# Altium schematic sheet FPGA Board Top.SchDoc
size C; SheetNumber: 1; SheetTotal: 4
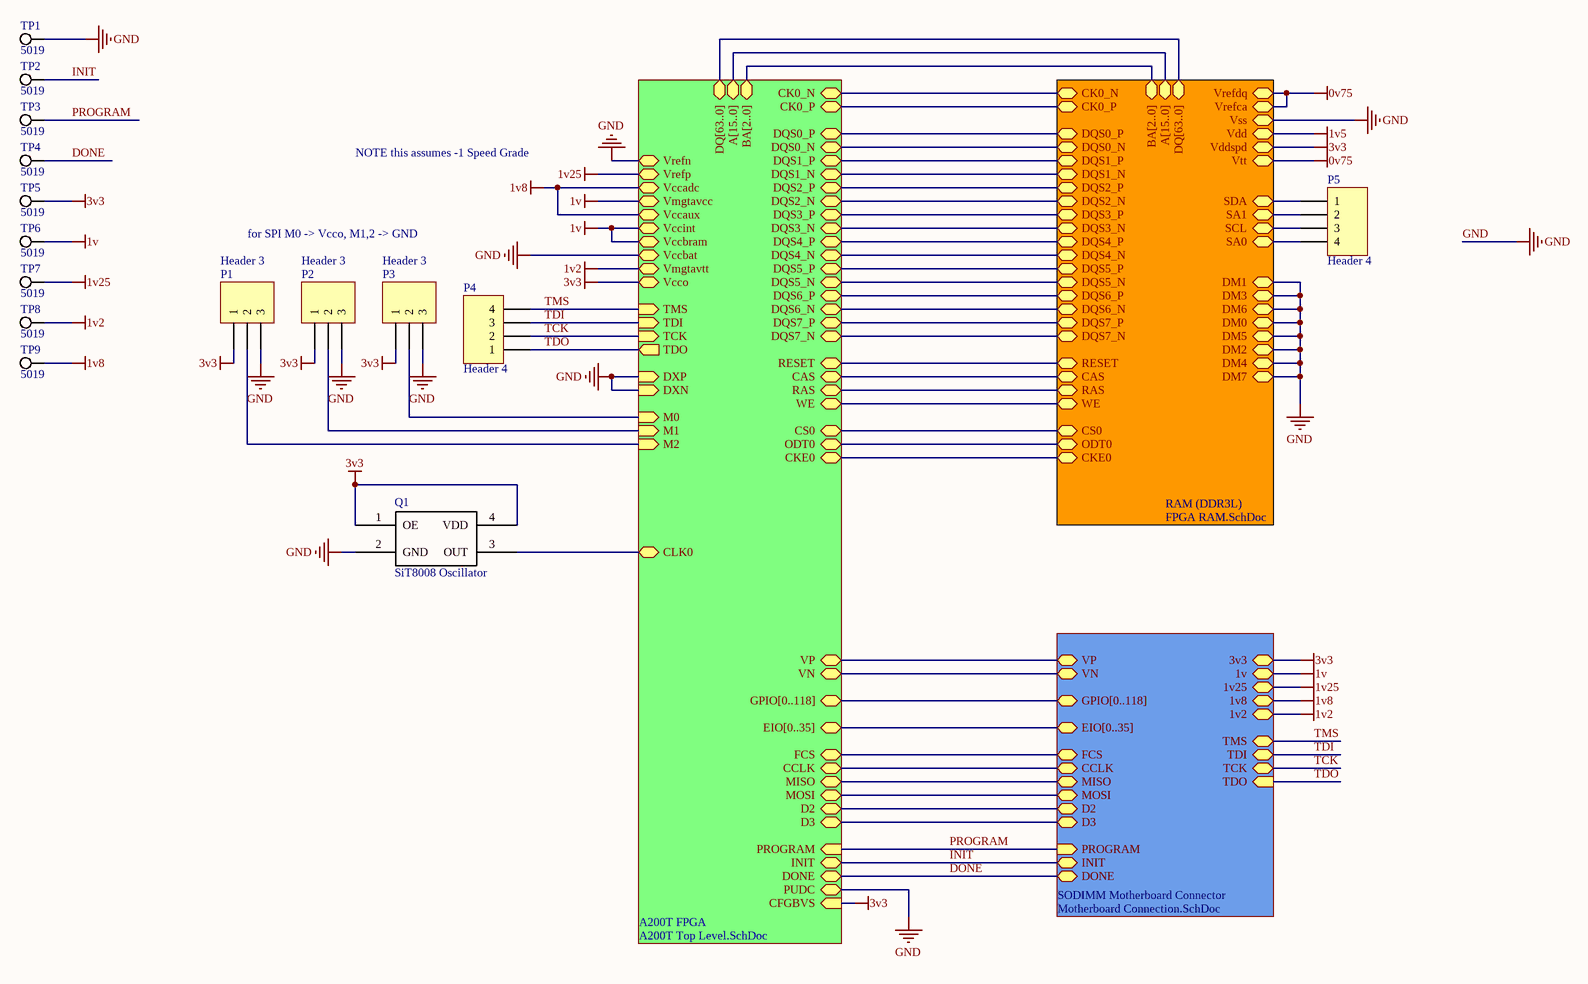
[diagram p0: FPGA Board Top.SchDoc]

## Parts
P1  Header 3  [HDR1X3]
P2  Header 3  [HDR1X3]
P3  Header 3  [HDR1X3]
P4  Header 4  [HDR1X4]
P5  Header 4  [HDR1X4]
Q1  SiT8008 Oscillator  [SiT8008 2.5x2]
TP1  5019  [KSTN-5019_V]
TP2  5019  [KSTN-5019_V]
TP3  5019  [KSTN-5019_V]
TP4  5019  [KSTN-5019_V]
TP5  5019  [KSTN-5019_V]
TP6  5019  [KSTN-5019_V]
TP7  5019  [KSTN-5019_V]
TP8  5019  [KSTN-5019_V]
TP9  5019  [KSTN-5019_V]

## Sub-sheets
A200T FPGA = A200T Top Level.SchDoc: BA[2..0] (bidir), A[15..0] (bidir), DQS1_P (bidir), DQS2_N (bidir), DQS7_N (bidir), DQS0_P (bidir), DQS6_N (bidir), DQS6_P (bidir), DQS1_N (bidir), DQS7_P (bidir), DQS4_P (bidir), DQS5_N (bidir), DQS3_P (bidir), DQS0_N (bidir), DQS2_P (bidir), DQS3_N (bidir), DQS4_N (bidir), DQS5_P (bidir), RAS (bidir), RESET (bidir), WE (bidir), CAS (bidir), CK0_P (bidir), CK0_N (bidir), ODT0 (bidir), CS0 (bidir), CKE0 (bidir), Vrefp (bidir), Vccadc (bidir), Vmgtavcc (bidir), Vccaux (bidir), Vccint (bidir), Vccbram (bidir), Vccbat (bidir), Vmgtavtt (bidir), Vcco (bidir), DQ[63..0] (bidir), Vrefn (bidir), PUDC (bidir), FCS (bidir), CCLK (bidir), INIT (bidir), MISO (bidir), DONE (bidir), MOSI (bidir), D2 (bidir), D3 (bidir), CLK0 (bidir), VP (bidir), VN (bidir), EIO[0..35] (bidir), GPIO[0..118] (bidir), TDO (out), CFGBVS (in), TMS (in), TCK (in), PROGRAM (in), TDI (in), DXP (in), M2 (in), M0 (in), DXN (in), M1 (in)
RAM (DDR3L) = FPGA RAM.SchDoc: Vrefdq (bidir), Vrefca (bidir), Vss (bidir), Vdd (bidir), DQS0_P (bidir), DQS6_N (bidir), DQS7_P (bidir), DQS1_P (bidir), DQS7_N (bidir), DQS3_P (bidir), DQS1_N (bidir), DQS4_N (bidir), DQS2_P (bidir), DQS5_P (bidir), DQS3_N (bidir), DQS4_P (bidir), DQS5_N (bidir), DQS2_N (bidir), DQS0_N (bidir), DQS6_P (bidir), SDA (bidir), SA1 (bidir), SCL (bidir), SA0 (bidir), Vddspd (bidir), Vtt (bidir), BA[2..0] (bidir), A[15..0] (bidir), CK0_N (bidir), CK0_P (bidir), RESET (bidir), CAS (bidir), RAS (bidir), WE (bidir), CS0 (bidir), ODT0 (bidir), CKE0 (bidir), DQ[63..0] (bidir), DM1 (bidir), DM3 (bidir), DM6 (bidir), DM0 (bidir), DM5 (bidir), DM2 (bidir), DM4 (bidir), DM7 (bidir)
SODIMM Motherboard Connector = Motherboard Connection.SchDoc: 3v3 (bidir), 1v (bidir), 1v25 (bidir), 1v8 (bidir), 1v2 (bidir), TDO (in), TMS (bidir), TCK (bidir), TDI (bidir), MOSI (bidir), D2 (bidir), MISO (bidir), FCS (bidir), D3 (bidir), CCLK (bidir), VP (bidir), VN (bidir), GPIO[0..118] (bidir), EIO[0..35] (bidir), PROGRAM (in), INIT (bidir), DONE (bidir)

## Nets
0v75: sheet RAM (DDR3L)/Vrefdq, sheet RAM (DDR3L)/Vrefca, sheet RAM (DDR3L)/Vtt
1v: TP6.1 ; sheet A200T FPGA/Vmgtavcc, sheet A200T FPGA/Vccint, sheet A200T FPGA/Vccbram, sheet SODIMM Motherboard Connector/1v
1v2: TP8.1 ; sheet A200T FPGA/Vmgtavtt, sheet SODIMM Motherboard Connector/1v2
1v5: sheet RAM (DDR3L)/Vdd
1v8: TP9.1 ; sheet A200T FPGA/Vccadc, sheet A200T FPGA/Vccaux, sheet SODIMM Motherboard Connector/1v8
1v25: TP7.1 ; sheet A200T FPGA/Vrefp, sheet SODIMM Motherboard Connector/1v25
3v3: P1.1 P2.1 P3.1 Q1.1(OE) Q1.4(VDD) TP5.1 ; sheet A200T FPGA/Vcco, sheet A200T FPGA/CFGBVS, sheet RAM (DDR3L)/Vddspd, sheet SODIMM Motherboard Connector/3v3
GND: P1.3 P2.3 P3.3 Q1.2(GND) TP1.1 ; sheet A200T FPGA/Vccbat, sheet A200T FPGA/Vrefn, sheet A200T FPGA/PUDC, sheet A200T FPGA/DXP, sheet A200T FPGA/DXN, sheet RAM (DDR3L)/Vss, sheet RAM (DDR3L)/DM1, sheet RAM (DDR3L)/DM3, sheet RAM (DDR3L)/DM6, sheet RAM (DDR3L)/DM0, sheet RAM (DDR3L)/DM5, sheet RAM (DDR3L)/DM2, sheet RAM (DDR3L)/DM4, sheet RAM (DDR3L)/DM7
DONE: TP4.1 ; sheet A200T FPGA/DONE, sheet SODIMM Motherboard Connector/DONE
INIT: TP2.1 ; sheet A200T FPGA/INIT, sheet SODIMM Motherboard Connector/INIT
PROGRAM: TP3.1 ; sheet A200T FPGA/PROGRAM, sheet SODIMM Motherboard Connector/PROGRAM
TCK: P4.2 ; sheet A200T FPGA/TCK, sheet SODIMM Motherboard Connector/TCK
TDI: P4.3 ; sheet A200T FPGA/TDI, sheet SODIMM Motherboard Connector/TDI
TDO: P4.1 ; sheet A200T FPGA/TDO, sheet SODIMM Motherboard Connector/TDO
TMS: P4.4 ; sheet A200T FPGA/TMS, sheet SODIMM Motherboard Connector/TMS
NetP1_2: P1.2 ; sheet A200T FPGA/M2
NetP2_2: P2.2 ; sheet A200T FPGA/M1
NetP3_2: P3.2 ; sheet A200T FPGA/M0
NetP5_1: P5.1 ; sheet RAM (DDR3L)/SDA
NetP5_2: P5.2 ; sheet RAM (DDR3L)/SA1
NetP5_3: P5.3 ; sheet RAM (DDR3L)/SCL
NetP5_4: P5.4 ; sheet RAM (DDR3L)/SA0
NetQ1_3: Q1.3(OUT) ; sheet A200T FPGA/CLK0
(unnamed): sheet A200T FPGA/DQS1_P, sheet RAM (DDR3L)/DQS1_P
(unnamed): sheet A200T FPGA/DQS2_N, sheet RAM (DDR3L)/DQS2_N
(unnamed): sheet A200T FPGA/DQS7_N, sheet RAM (DDR3L)/DQS7_N
(unnamed): sheet A200T FPGA/DQS0_P, sheet RAM (DDR3L)/DQS0_P
(unnamed): sheet A200T FPGA/DQS6_N, sheet RAM (DDR3L)/DQS6_N
(unnamed): sheet A200T FPGA/DQS6_P, sheet RAM (DDR3L)/DQS6_P
(unnamed): sheet A200T FPGA/DQS1_N, sheet RAM (DDR3L)/DQS1_N
(unnamed): sheet A200T FPGA/DQS7_P, sheet RAM (DDR3L)/DQS7_P
(unnamed): sheet A200T FPGA/DQS4_P, sheet RAM (DDR3L)/DQS4_P
(unnamed): sheet A200T FPGA/DQS5_N, sheet RAM (DDR3L)/DQS5_N
(unnamed): sheet A200T FPGA/DQS3_P, sheet RAM (DDR3L)/DQS3_P
(unnamed): sheet A200T FPGA/DQS0_N, sheet RAM (DDR3L)/DQS0_N
(unnamed): sheet A200T FPGA/DQS2_P, sheet RAM (DDR3L)/DQS2_P
(unnamed): sheet A200T FPGA/DQS3_N, sheet RAM (DDR3L)/DQS3_N
(unnamed): sheet A200T FPGA/DQS4_N, sheet RAM (DDR3L)/DQS4_N
(unnamed): sheet A200T FPGA/DQS5_P, sheet RAM (DDR3L)/DQS5_P
(unnamed): sheet A200T FPGA/RAS, sheet RAM (DDR3L)/RAS
(unnamed): sheet A200T FPGA/RESET, sheet RAM (DDR3L)/RESET
(unnamed): sheet A200T FPGA/WE, sheet RAM (DDR3L)/WE
(unnamed): sheet A200T FPGA/CAS, sheet RAM (DDR3L)/CAS
(unnamed): sheet A200T FPGA/CK0_P, sheet RAM (DDR3L)/CK0_P
(unnamed): sheet A200T FPGA/CK0_N, sheet RAM (DDR3L)/CK0_N
(unnamed): sheet A200T FPGA/ODT0, sheet RAM (DDR3L)/ODT0
(unnamed): sheet A200T FPGA/CS0, sheet RAM (DDR3L)/CS0
(unnamed): sheet A200T FPGA/CKE0, sheet RAM (DDR3L)/CKE0
(unnamed): sheet A200T FPGA/FCS, sheet SODIMM Motherboard Connector/FCS
(unnamed): sheet A200T FPGA/CCLK, sheet SODIMM Motherboard Connector/CCLK
(unnamed): sheet A200T FPGA/MISO, sheet SODIMM Motherboard Connector/MISO
(unnamed): sheet A200T FPGA/MOSI, sheet SODIMM Motherboard Connector/MOSI
(unnamed): sheet A200T FPGA/D2, sheet SODIMM Motherboard Connector/D2
(unnamed): sheet A200T FPGA/D3, sheet SODIMM Motherboard Connector/D3
(unnamed): sheet A200T FPGA/VP, sheet SODIMM Motherboard Connector/VP
(unnamed): sheet A200T FPGA/VN, sheet SODIMM Motherboard Connector/VN

## Buses and harness runs
bus sheet A200T FPGA/A[15..0] = sheet RAM (DDR3L)/A[15..0]
bus sheet A200T FPGA/BA[2..0] = sheet RAM (DDR3L)/BA[2..0]
bus sheet A200T FPGA/DQ[63..0] = sheet RAM (DDR3L)/DQ[63..0]
bus sheet A200T FPGA/EIO[0..35] = sheet SODIMM Motherboard Connector/EIO[0..35]
bus sheet A200T FPGA/GPIO[0..118] = sheet SODIMM Motherboard Connector/GPIO[0..118]

## Notes on the sheet
- NOTE this assumes -1 Speed Grade
- for SPI M0 -> Vcco, M1,2 -> GND

## Library data of the parts
P1-P3 = Header 3: Header, 3-Pin; LatestRevisionDate: 17-Jul-2002; LatestRevisionNote: Re-released for DXP Platform.; Publisher: Altium Limited
P4 P5 = Header 4: Header, 4-Pin; LatestRevisionDate: 17-Jul-2002; LatestRevisionNote: Re-released for DXP Platform.; Publisher: Altium Limited
TP1-TP9 = CMP-1672-00008-1: Test Point, 1 Position SMD, RoHS, Tape and Reel; ComponentLink1Description: Manufacturer URL; Package Quantity: 1000; DatasheetVersion: 03/2014; Packaging: Tape and Reel; ComponentLink2URL: http://www.keyelco.com/product-pdf.cfm?p=1357; ComponentLink1URL: http://www.keyelco.com/; Mount: Surface Mount; Contact Plating: Silver; PackageDescription: 1-Pin Surface Mount Device, Body 3.81 x 2.03 mm; Pins: 1; RoHSCompliant: True; Mounting Technology: Surface Mount; ComponentLink2Description: Datasheet; PackageReference: 5019